# Altium schematic sheet Sheet1.SchDoc
size A4
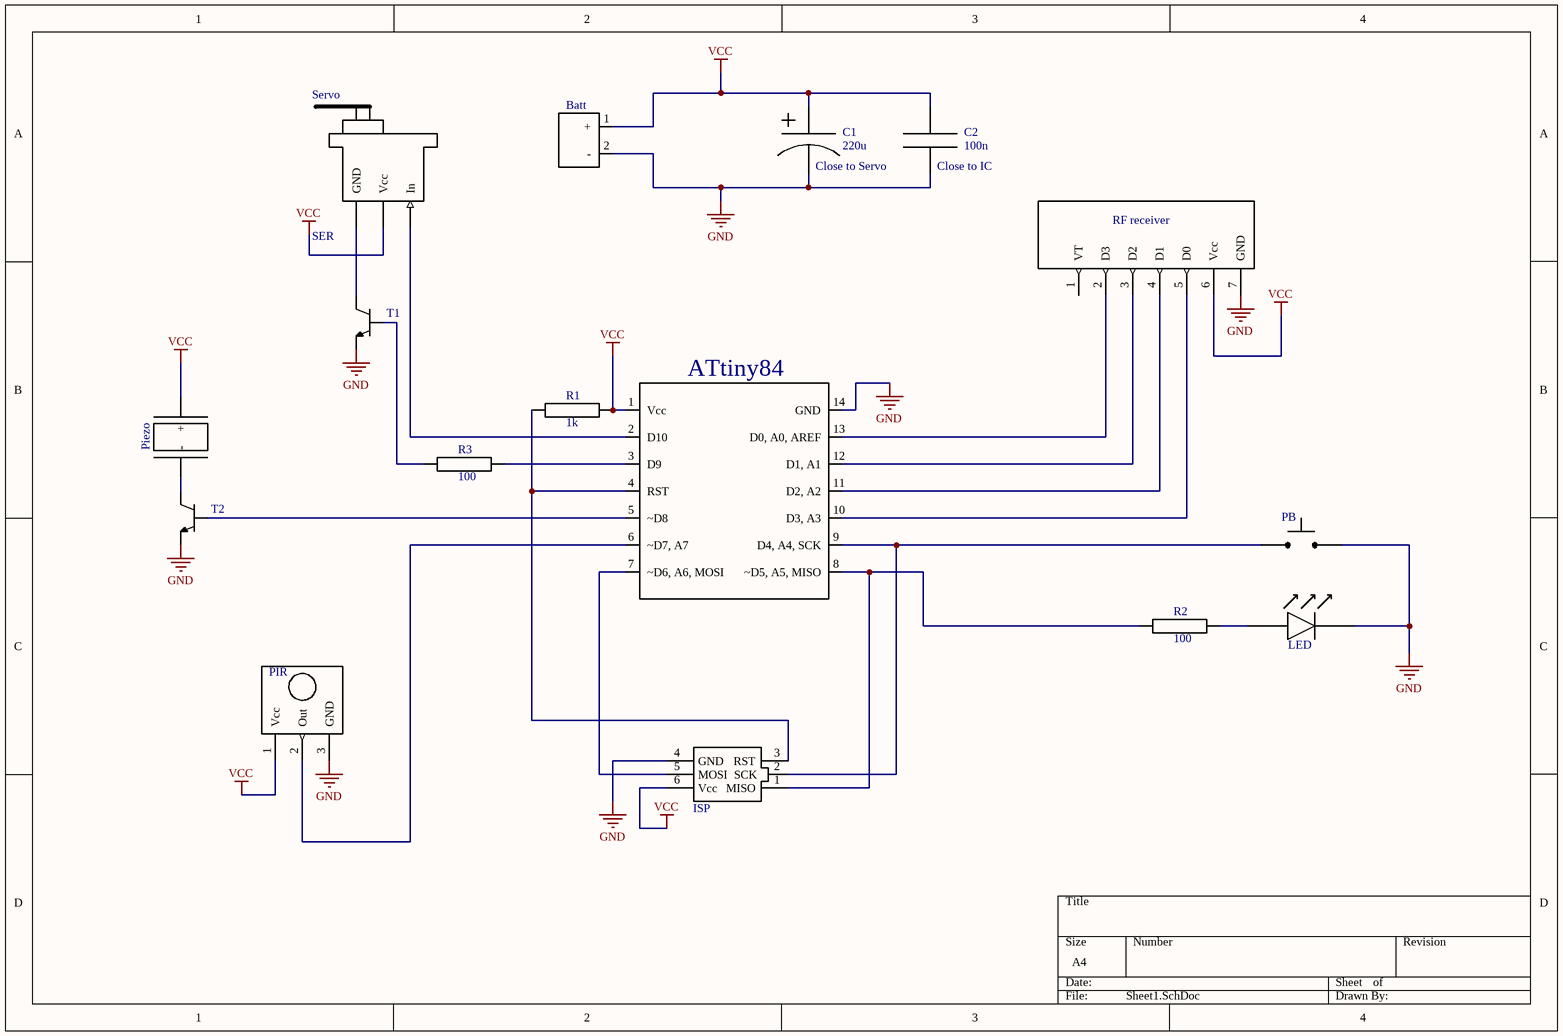
[diagram p0: Sheet1.SchDoc]

## Parts
Batt  Batt  [Battery - Terminal holder small]  (value not drawn)
C1  value 220u  [Electrolytic capacitor 5x12 - Horizontal]  (hidden comment: Electrolytic capacitor)
C2  value 100n  [Ceramic capacitor]  (hidden comment: Ceramic capacitor)
IC  ATtiny84  [SOC 7x2]
ISP  ISP header 2x3 male  [ISP header 2x3 male]  (value not drawn)
LED  LED 5mm  [LED 5mm red]  (value not drawn)
PB  PB  [Pushbutton big]  (value not drawn)
PIR  PIR  [PIR]  (value not drawn)
Pzo  Piezo  [Piezo (Encapsulated)]
R1  value 1k  [Resistor SMD 0805]  (hidden comment: Resistor)
R2  value 100  [Resistor SMD 0805]  (hidden comment: Resistor)
R3  value 100  [Resistor SMD 0805]  (hidden comment: Resistor)
RFrec?  RF receiver  [4 channel 315mhz RF reciever]
Servo  SER  [Servo - 3 pin 90º]
T1  PN2222a  [PN2222a]  (value not drawn)
T2  PN2222a  [PN2222a]  (value not drawn)

## Nets
GND: Batt.2(-) C1.2 C2.2 IC.14(GND) ISP.4(GND) LED.2(K) PB.2 PIR.3(GND) RFrec?.7(GND) T1.1(DT) T2.1(DT)
VCC: Batt.1(+) C1.1 C2.1 IC.1(Vcc) ISP.6(Vcc) PIR.1(Vcc) Pzo.1(+) R1.2 RFrec?.6(Vcc) Servo.2(Vcc)
NetIC_2: IC.2(D10) Servo.1(In)
NetIC_3: IC.3(D9) R3.2
NetIC_4: IC.4(RST) ISP.3(RST) R1.1
NetIC_5: IC.5(~D8) T2.2(DT)
NetIC_6: IC.6(~D7,_A7) PIR.2(Out)
NetIC_7: IC.7(~D6,_A6,_MOSI) ISP.5(MOSI)
NetIC_8: IC.8(~D5,_A5,_MISO) ISP.1(MISO) R2.1
NetIC_9: IC.9(D4,_A4,_SCK) ISP.2(SCK) PB.1
NetIC_10: IC.10(D3,_A3) RFrec?.5(D0)
NetIC_11: IC.11(D2,_A2) RFrec?.4(D1)
NetIC_12: IC.12(D1,_A1) RFrec?.3(D2)
NetIC_13: IC.13(D0,_A0,_AREF) RFrec?.2(D3)
NetLED_1: LED.1(A) R2.2
NetPzo_2: Pzo.2(-) T2.3(DT)
NetR3_1: R3.1 T1.2(DT)
NetServo_3: Servo.3(GND) T1.3(DT)

Not connected (* = marked no-connect by the designer): RFrec? 1(VT)

## Notes on the sheet
- (near C1) Close to Servo
- (near C2) Close to IC

## Library data of the parts
Batt = Battery - Terminal header small: Connector for cables from a battery holder
PB = Pushbutton
Pzo = Piezo (Encapsulated)
RFrec? = 4 channel 315mhz RF reciever
Servo = Servo
LED = LED 5mm: Color: *